# Altium schematic sheet TB_Piste.SchDoc
size A3; SheetNumber: 1; SheetTotal: 3
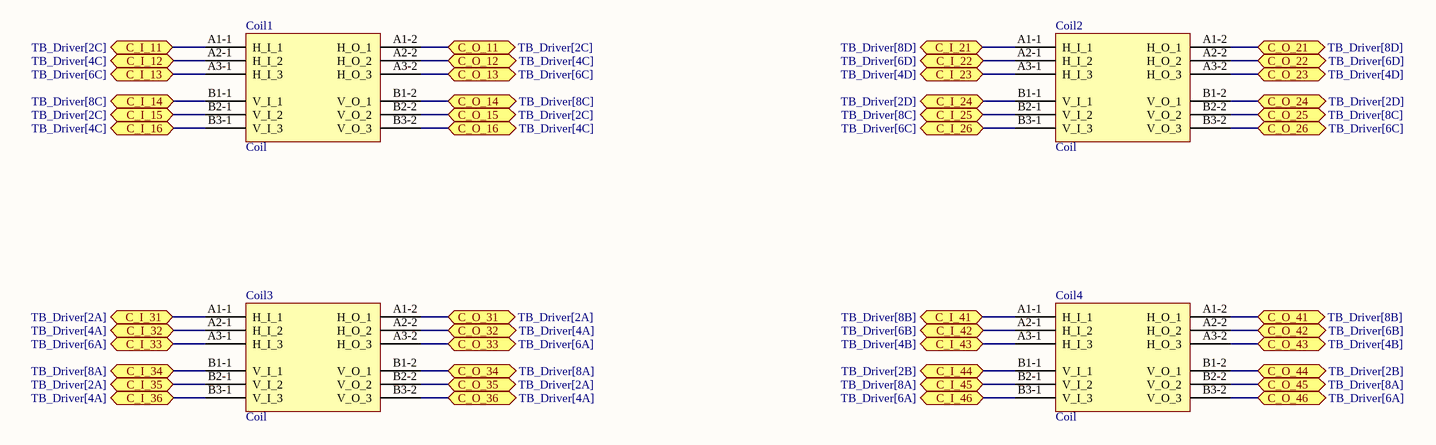
[diagram p0: TB_Piste.SchDoc]

## Parts
Coil1  Coil  [Bidirectional_Coil]
Coil2  Coil  [Bidirectional_Coil]
Coil3  Coil  [Bidirectional_Coil]
Coil4  Coil  [Bidirectional_Coil]

## Ports
C_I_11 (bidir, see TB_Driver[2C]), C_I_12 (bidir, see TB_Driver[4C]), C_I_13 (bidir, see TB_Driver[6C]), C_I_14 (bidir, see TB_Driver[8C]), C_I_15 (bidir, see TB_Driver[2C]), C_I_16 (bidir, see TB_Driver[4C]), C_I_21 (bidir, see TB_Driver[8D]), C_I_22 (bidir, see TB_Driver[6D]), C_I_23 (bidir, see TB_Driver[4D]), C_I_24 (bidir, see TB_Driver[2D]), C_I_25 (bidir, see TB_Driver[8C]), C_I_26 (bidir, see TB_Driver[6C]), C_I_31 (bidir, see TB_Driver[2A]), C_I_32 (bidir, see TB_Driver[4A]), C_I_33 (bidir, see TB_Driver[6A]), C_I_34 (bidir, see TB_Driver[8A]), C_I_35 (bidir, see TB_Driver[2A]), C_I_36 (bidir, see TB_Driver[4A]), C_I_41 (bidir, see TB_Driver[8B]), C_I_42 (bidir, see TB_Driver[6B]), C_I_43 (bidir, see TB_Driver[4B]), C_I_44 (bidir, see TB_Driver[2B]), C_I_45 (bidir, see TB_Driver[8A]), C_I_46 (bidir, see TB_Driver[6A]), C_O_11 (bidir, see TB_Driver[2C]), C_O_12 (bidir, see TB_Driver[4C]), C_O_13 (bidir, see TB_Driver[6C]), C_O_14 (bidir, see TB_Driver[8C]), C_O_15 (bidir, see TB_Driver[2C]), C_O_16 (bidir, see TB_Driver[4C]), C_O_21 (bidir, see TB_Driver[8D]), C_O_22 (bidir, see TB_Driver[6D]), C_O_23 (bidir, see TB_Driver[4D]), C_O_24 (bidir, see TB_Driver[2D]), C_O_25 (bidir, see TB_Driver[8C]), C_O_26 (bidir, see TB_Driver[6C]), C_O_31 (bidir, see TB_Driver[2A]), C_O_32 (bidir, see TB_Driver[4A]), C_O_33 (bidir, see TB_Driver[6A]), C_O_34 (bidir, see TB_Driver[8A]), C_O_35 (bidir, see TB_Driver[2A]), C_O_36 (bidir, see TB_Driver[4A]), C_O_41 (bidir, see TB_Driver[8B]), C_O_42 (bidir, see TB_Driver[6B]), C_O_43 (bidir, see TB_Driver[4B]), C_O_44 (bidir, see TB_Driver[2B]), C_O_45 (bidir, see TB_Driver[8A]), C_O_46 (bidir, see TB_Driver[6A])

## Nets
C_I_11: Coil1.A1-1(H_I_1) ; port C_I_11
C_I_12: Coil1.A2-1(H_I_2) ; port C_I_12
C_I_13: Coil1.A3-1(H_I_3) ; port C_I_13
C_I_14: Coil1.B1-1(V_I_1) ; port C_I_14
C_I_15: Coil1.B2-1(V_I_2) ; port C_I_15
C_I_16: Coil1.B3-1(V_I_3) ; port C_I_16
C_I_21: Coil2.A1-1(H_I_1) ; port C_I_21
C_I_22: Coil2.A2-1(H_I_2) ; port C_I_22
C_I_23: Coil2.A3-1(H_I_3) ; port C_I_23
C_I_24: Coil2.B1-1(V_I_1) ; port C_I_24
C_I_25: Coil2.B2-1(V_I_2) ; port C_I_25
C_I_26: Coil2.B3-1(V_I_3) ; port C_I_26
C_I_31: Coil3.A1-1(H_I_1) ; port C_I_31
C_I_32: Coil3.A2-1(H_I_2) ; port C_I_32
C_I_33: Coil3.A3-1(H_I_3) ; port C_I_33
C_I_34: Coil3.B1-1(V_I_1) ; port C_I_34
C_I_35: Coil3.B2-1(V_I_2) ; port C_I_35
C_I_36: Coil3.B3-1(V_I_3) ; port C_I_36
C_I_41: Coil4.A1-1(H_I_1) ; port C_I_41
C_I_42: Coil4.A2-1(H_I_2) ; port C_I_42
C_I_43: Coil4.A3-1(H_I_3) ; port C_I_43
C_I_44: Coil4.B1-1(V_I_1) ; port C_I_44
C_I_45: Coil4.B2-1(V_I_2) ; port C_I_45
C_I_46: Coil4.B3-1(V_I_3) ; port C_I_46
C_O_11: Coil1.A1-2(H_O_1) ; port C_O_11
C_O_12: Coil1.A2-2(H_O_2) ; port C_O_12
C_O_13: Coil1.A3-2(H_O_3) ; port C_O_13
C_O_14: Coil1.B1-2(V_O_1) ; port C_O_14
C_O_15: Coil1.B2-2(V_O_2) ; port C_O_15
C_O_16: Coil1.B3-2(V_O_3) ; port C_O_16
C_O_21: Coil2.A1-2(H_O_1) ; port C_O_21
C_O_22: Coil2.A2-2(H_O_2) ; port C_O_22
C_O_23: Coil2.A3-2(H_O_3) ; port C_O_23
C_O_24: Coil2.B1-2(V_O_1) ; port C_O_24
C_O_25: Coil2.B2-2(V_O_2) ; port C_O_25
C_O_26: Coil2.B3-2(V_O_3) ; port C_O_26
C_O_31: Coil3.A1-2(H_O_1) ; port C_O_31
C_O_32: Coil3.A2-2(H_O_2) ; port C_O_32
C_O_33: Coil3.A3-2(H_O_3) ; port C_O_33
C_O_34: Coil3.B1-2(V_O_1) ; port C_O_34
C_O_35: Coil3.B2-2(V_O_2) ; port C_O_35
C_O_36: Coil3.B3-2(V_O_3) ; port C_O_36
C_O_41: Coil4.A1-2(H_O_1) ; port C_O_41
C_O_42: Coil4.A2-2(H_O_2) ; port C_O_42
C_O_43: Coil4.A3-2(H_O_3) ; port C_O_43
C_O_44: Coil4.B1-2(V_O_1) ; port C_O_44
C_O_45: Coil4.B2-2(V_O_2) ; port C_O_45
C_O_46: Coil4.B3-2(V_O_3) ; port C_O_46